# Altium schematic sheet microSD.SchDoc
size A4; SheetNumber: 6; SheetTotal: 6; SPICEModelCacheQHUFGKIC: <root> / <DocumentId>QHUFGKIC</DocumentId> / <CacheFrame Number="0"> / <Model Name="umk107bj105_a-t" Kind="CKT"> / <Text>* UMK107BJ105_A-T     SPICE MODEL  ( General Type ) / *-------------------------------------------------------------------------------------------------------- / * Model Generated by TAIYO YUDEN Corporation (http://www.ty-top.com) / * Version 1.0 / * TAIYO YUDEN Control No. 170508_130520 / * Copyright(c) 2012 TAIYO YUDEN CO.,LTD. All Rights Reserved. / *-------------------------------------------------------------------------------------------------------- / * / * Products Name : Multilayer Ceramic Capacitors / * / * Characteristics : / *     Capacitance : 1 uF , Rated Voltage : 50V , TCC : X5R / *     Case Size : 1.6 x 0.8 / 0.063 x 0.031 [mm/inch] , Thickness : 0.8 / 0.031 [mm/inch] / *     (Conditions: Temperature = 25 degC , DC Bias Current/Voltage = 0A / 0V) / * / * Frequency Range : 40Hz - 3GHz / * / * External Node Assignments : / * / *  1  o---| |---o  2 / * / *-------------------------------------------------------------------------------------------------------- / .SubCkt UMK107BJ105_A-T 1 2 / **************************** / C0 1 110 0.79929u / Cm 1 101 0.13681u / C1 101 102 0.26224u / Rc1 101 102 5.8806k / C2 102 103 0.057839u / Rc2 102 103 469.42 / C3 103 110 0.014568u / Rc3 103 110 14.853 / C2m 1 301 0.13283u / C21 301 302 1.2593u / Rc21 301 302 6.3079k / C22 302 303 1.1189u / Rc22 302 303 6.9405k / C23 303 304 1.1421u / Rc23 303 304 6.4848k / C24 304 305 0.36861u / Rc24 304 305 785 / C25 305 306 0.39327u / Rc25 305 306 637.41 / C26 306 307 0.27451u / Rc26 306 307 19.365 / C27 307 308 0.15295u / Rc27 307 308 23.239 / C28 308 309 0.17569u / Rc28 308 309 17.788 / C29 309 110 1420.6p / Rc29 309 110 1.9725 / Rp0 1 110 500Meg / L0 110 120 0.24088n / Lm 120 130 0.1369n / L1 120 121 0.1842n / RL1 121 130 0.29804 / L2 120 122 0.40657n / RL2 122 130 0.57395 / L3 120 123 0.85773n / RL3 123 130 0.82282 / CR 120 124 0.11463u / LR 124 125 0.25983n / RR 125 130 52.447m / CL 130 140 1.4637p / LL 130 140 0.23986n / RL 130 140 33.985 / Rs 140 2 6.8539m / **************************** / .ends UMK107BJ105_A-T</Text> / </Model> / </CacheFrame> / </root>
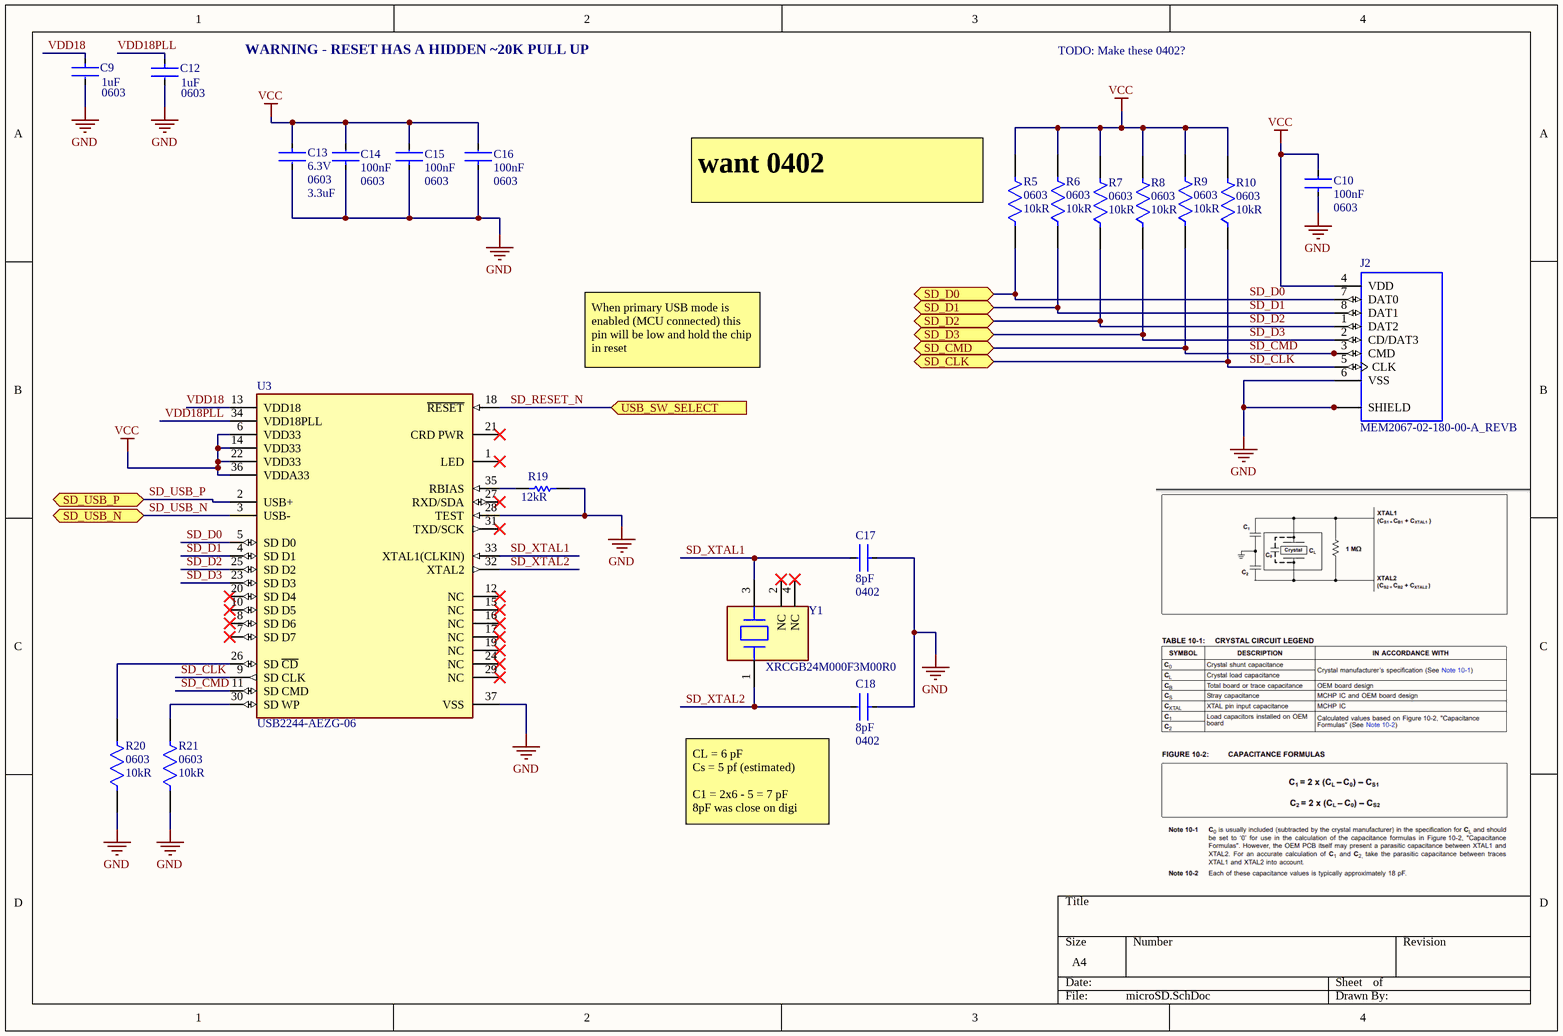
[diagram p0: microSD.SchDoc]

## Parts
C9  Case/Package: 0603  Capacitance: 1uF  [FP-0603-L_1_6_0_1-W_0_8_0-IPC_A]  (hidden comment: UMK107BJ105KA-T)
C10  Capacitance: 100nF  Case/Package: 0603  [FP-CL10-IPC_A]  (hidden comment: CL10B104KB8WPNC)
C12  Case/Package: 0603  Capacitance: 1uF  [FP-0603-L_1_6_0_1-W_0_8_0-IPC_A]  (hidden comment: UMK107BJ105KA-T)
C13  Voltage Rating: 6.3V  Case Code (Imperial): 0603  Capacitance: 3.3uF  [FP-C1608-080-0_1-MFG]  (hidden comment: C1608X7S0J335K080AC)
C14  Capacitance: 100nF  Case/Package: 0603  [FP-CL10-IPC_A]  (hidden comment: CL10B104KB8WPNC)
C15  Capacitance: 100nF  Case/Package: 0603  [FP-CL10-IPC_A]  (hidden comment: CL10B104KB8WPNC)
C16  Capacitance: 100nF  Case/Package: 0603  [FP-CL10-IPC_A]  (hidden comment: CL10B104KB8WPNC)
C17  Capacitance: 8pF  Package: 0402  [FP-CL522-IPC_C]  (hidden comment: CL05C080DB51PNC)
C18  Capacitance: 8pF  Package: 0402  [FP-CL522-IPC_C]  (hidden comment: CL05C080DB51PNC)
J2  MEM2067-02-180-00-A_REVB  [GCT_MEM2067-02-180-00-A_REVB]
R5  Case Code (Imperial): 0603  Resistance: 10kR  [FP-RMCF0603-MFG]  (hidden comment: RMCF0603JG10K0)
R6  Case Code (Imperial): 0603  Resistance: 10kR  [FP-RMCF0603-MFG]  (hidden comment: RMCF0603JG10K0)
R7  Case Code (Imperial): 0603  Resistance: 10kR  [FP-RMCF0603-MFG]  (hidden comment: RMCF0603JG10K0)
R8  Case Code (Imperial): 0603  Resistance: 10kR  [FP-RMCF0603-MFG]  (hidden comment: RMCF0603JG10K0)
R9  Case Code (Imperial): 0603  Resistance: 10kR  [FP-RMCF0603-MFG]  (hidden comment: RMCF0603JG10K0)
R10  Case Code (Imperial): 0603  Resistance: 10kR  [FP-RMCF0603-MFG]  (hidden comment: RMCF0603JG10K0)
R19  Resistance: 12kR  [RESC1608X55X25LL10T15]  (hidden comment: RC0603FR-1312KL)
R20  Case Code (Imperial): 0603  Resistance: 10kR  [FP-RMCF0603-MFG]  (hidden comment: RMCF0603JG10K0)
R21  Case Code (Imperial): 0603  Resistance: 10kR  [FP-RMCF0603-MFG]  (hidden comment: RMCF0603JG10K0)
U3  USB2244-AEZG-06  [FP-36QFN-4106-6x6B-MFG]
Y1  XRCGB24M000F3M00R0  [FP-XRCGB_F_N-MFG]

## Ports
SD_CLK (bidir), SD_CMD (bidir), SD_D0 (bidir), SD_D1 (bidir), SD_D2 (bidir), SD_D3 (bidir), SD_USB_N (bidir), SD_USB_P (bidir), USB_SW_SELECT (in)

## Nets
GND: C9.2 C10.1 C12.2 C13.1 C14.1 C15.1 C16.1 C17.1 C18.1 J2.6(VSS) J2.9(SHIELD) J2.10(SHIELD) J2.11(SHIELD) J2.12(SHIELD) R19.2 R20.1 R21.1 U3.28(TEST) U3.37(VSS)
VCC: C10.2 C13.2 C14.2 C15.2 C16.2 J2.4(VDD) R5.2 R6.2 R7.2 R8.2 R9.2 R10.2 U3.6(VDD33) U3.14(VDD33) U3.22(VDD33) U3.36(VDDA33)
SD_CLK: J2.5(CLK) R10.1 U3.9(SD_CLK) ; port SD_CLK
SD_CMD: J2.3(CMD) R9.1 U3.11(SD_CMD) ; port SD_CMD
SD_D0: J2.7(DAT0) R5.1 U3.5(SD_D0) ; port SD_D0
SD_D1: J2.8(DAT1) R6.1 U3.4(SD_D1) ; port SD_D1
SD_D2: J2.1(DAT2) R7.1 U3.25(SD_D2) ; port SD_D2
SD_D3: J2.2(CD/DAT3) R8.1 U3.23(SD_D3) ; port SD_D3
SD_RESET_N: U3.18(~{RESET}) ; port USB_SW_SELECT
SD_USB_N: U3.3(USB-) ; port SD_USB_N
SD_USB_P: U3.2(USB+) ; port SD_USB_P
SD_XTAL1: C17.2 U3.33(XTAL1(CLKIN)) Y1.3(2_Input/Output)
SD_XTAL2: C18.2 U3.32(XTAL2) Y1.1(1_Input/Output)
VDD18: C9.1 U3.13(VDD18)
VDD18PLL: C12.1 U3.34(VDD18PLL)
NetR19_1: R19.1 U3.35(RBIAS)
NetR20_2: R20.2 U3.26(SD_~{CD})
NetR21_2: R21.2 U3.30(SD_WP)

Not connected (* = marked no-connect by the designer): U3 1(LED)* 7(SD_D7)* 8(SD_D6)* 10(SD_D5)* 12(NC)* 15(NC)* 16(NC)* 17(NC)* 19(NC)* 20(SD_D4)* 21(CRD_PWR)* 24(NC)* 27(RXD/SDA)* 29(NC)* 31(TXD/SCK)*; Y1 2(NC)* 4(NC)*

## Notes on the sheet
- WARNING - RESET HAS A HIDDEN ~20K PULL UP
- TODO: Make these 0402?
- (near R5) want 0402
- When primary USB mode is enabled (MCU connected) this pin will be low and hold the chip in reset
- (near C18) CL = 6 pF
  Cs = 5 pf (estimated)
  C1 = 2x6 - 5 = 7 pF
  8pF was close on digi

## Library data of the parts
C9 C12 = CMP-2000-05447-3: None; Tolerance: 10%; Voltage Rating: 50V; Dielectric: X5R; Height: 0.8mm; Depth: 0.8mm; Number of Pins: 2; Length: 1.6mm; Thickness: 0.035inch; Contact Plating: Nickel; Radiation Hardening: No; Package Quantity: 1; Halogen Free: Halogen Free; RoHS Compliant: Yes; Termination: SMD/SMT; Max Operating Temperature: 85°C; Min Operating Temperature: -55°C; Case Code (Metric): 1608; Construction: Flat; Voltage Rating (DC): 50V; Packaging: Tape and Reel; Series: M; Case Code (Imperial): 0603; Width: 0.031inch; Mount: Surface Mount
C10 C14-C16 = CMP-13271-002353-1: Cap Ceramic 100nF 50V X7R ±10% Pad SMD 0603 +125°C T/R; Ratings: AEC-Q200; Features: Soft Termination; Max Operating Temperature: 125°C; Mount: Surface Mount; Width: 0.031inch; Voltage Rating: 50V; Case Code (Metric): 1608; Case Code (Imperial): 0603; Tolerance: 10%; Min Operating Temperature: -55°C; Thickness: 0.035inch; Lead Free: Lead Free; Packaging: Tape and Reel; Length: 0.063inch
C13 = CMP-08246-006760-1: Multilayer Ceramic Capacitors 3.3μF ±10% 6.3V X7S SMD 0603; Max Operating Temperature: 125°C; Lead Free: Lead Free; Min Operating Temperature: -55°C; Dielectric Material: Ceramic; Voltage Rating (DC): 6.3V; Case/Package: 0603; Thickness: 0.035inch; RoHS Compliant: Yes; Mount: Surface Mount; Width: 0.031inch; Tolerance: 10%; Case Code (Metric): 1608; Package Quantity: 4000; Series: C; Length: 0.063inch; Packaging: Tape and Reel
C17 C18 = CMP-13271-000662-1: Cap Ceramic 8pF 50V C0G ±0.5pF SMD 0402 +125°C Paper T/R
J2 = MEM2067-02-180-00-A_REVB: Micro SD Memory Card ConnectorSMT, Hinged, 1.80mm Profile; Value: *; MP: MEM2067-02-180-00-A_REVB; Package: None; Availability: Unavailable; Price: None
R5-R10 R20 R21 = CMP-26527-000153-1: 10kΩ ±5% 0.1W 0603 Thick Film Chip Resistor AEC-Q200 compliant; Temperature Coefficient: 200ppm/°C; Max Power Dissipation: 100mW; Tolerance: 5%; Series: RMCF; Resistor Type: Thick Film; Length: 0.061inch; Features: Automotive AEC-Q200; Height: 0.022inch; Case Code (Metric): 1608; Width: 0.031inch; Number of Terminations: 2; Contact Plating: Tin; Case/Package: 0603; Package Quantity: 1; Max Operating Temperature: 155°C; Mount: Surface Mount; RoHS Compliant: Yes; Radiation Hardening: No; Min Operating Temperature: -55°C; Packaging: Tape and Reel
R19 = CMP-2000-04198-1: Manufacturer: Yageo; Part Number: RC0603FR-1312KL
U3 = CMP-06284-000024-1: IC MEDIA CTRLR USB 2.0 36-QFNE3; Data Rate: 35Mbps; Number of Transceivers: 1; Max Supply Voltage: 3.6V; Operating Supply Voltage: 3.3V; Min Supply Voltage: 3V; Operating Supply Current: 135mA; Interface: Serial; Mount: Surface Mount; Case/Package: QFN; Height: 0.95mm; Max Operating Temperature: 70°C; Lead Free: Lead Free; Package Quantity: 490; Width: 6.15mm; Min Operating Temperature: 0°C; Radiation Hardening: No; REACH SVHC: No SVHC; Length: 6.15mm; Number of Pins: 36; RoHS Compliant: Yes; Series: *; Packaging: Tray
Y1 = CMP-06054-000017-1: CRYSTAL 24.0000MHZ 6PF SMD; ESR (Equivalent Series Resistance): 150R; Operating Frequency: 24 MHz; Tolerance: 30ppm; Frequency: 24MHz; Frequency Stability: 40ppm; Length: 2mm; Height: 0.028inch; Lead Free: Lead Free; Min Operating Temperature: -30°C; REACH SVHC: No SVHC; RoHS Compliant: Yes; Series Resistance: 150R; Mount: Surface Mount; Packaging: Tape and Reel; Termination: SMD/SMT; Case/Package: SMD/SMT; Max Operating Temperature: 85°C; Width: 1.6mm; Number of Pins: 4; Load Capacitance: 6pF; Package Quantity: 1; Depth: 1.6mm; Frequency Tolerance: 30ppm; Series: XRCGB